# Altium schematic sheet MC21R01_Top_Level.SchDoc: MC21R01 Top Level
size A3; Author: AMP; DrawnBy: AMP; Organization: Altium Limited; Address1: 3 Minna Close; Address2: Belrose; Address3: NSW 2085; Address4: Australia; DocumentNumber: 0; Revision: 1.0; SheetNumber: 0; SheetTotal: 0
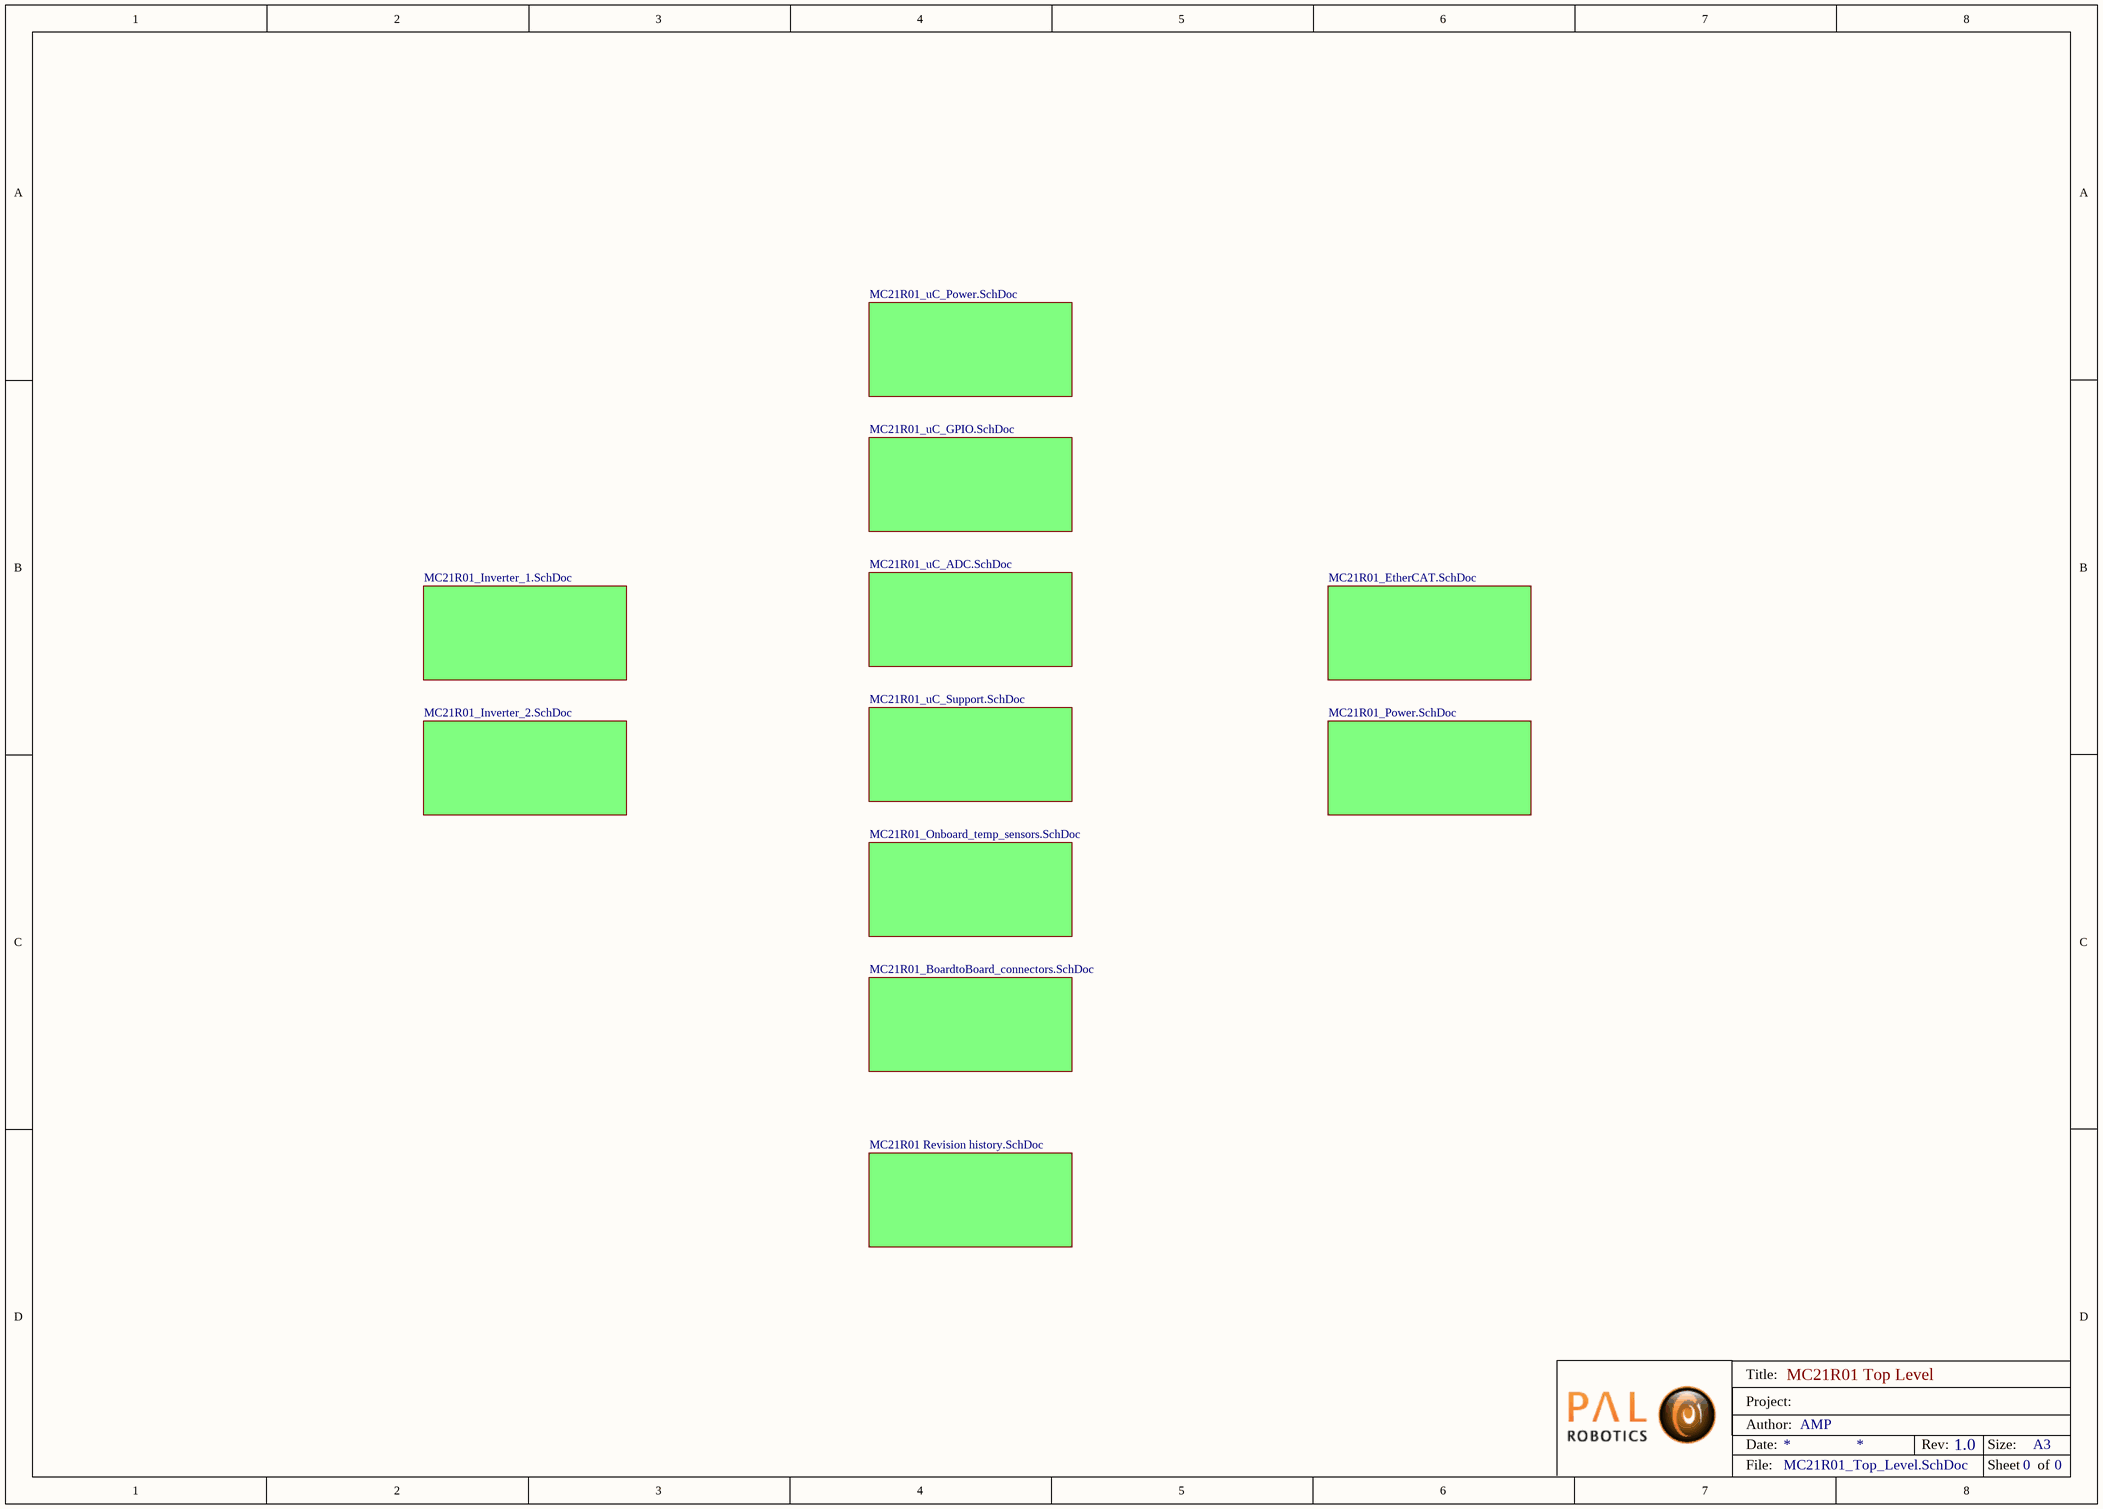
[diagram p0: MC21R01_Top_Level.SchDoc]

## Sub-sheets
? = MC21R01 Revision history.SchDoc: no entries
? = MC21R01_uC_Support.SchDoc: no entries
? = MC21R01_uC_Power.SchDoc: no entries
? = MC21R01_uC_GPIO.SchDoc: no entries
? = MC21R01_Inverter_1.SchDoc: no entries
? = MC21R01_Inverter_2.SchDoc: no entries
? = MC21R01_Onboard_temp_sensors.SchDoc: no entries
? = MC21R01_uC_ADC.SchDoc: no entries
? = MC21R01_EtherCAT.SchDoc: no entries
? = MC21R01_BoardtoBoard_connectors.SchDoc: no entries
? = MC21R01_Power.SchDoc: no entries

## Notes on the sheet
- Title:
- Date:
- Project:
- Author:
- Rev:
- Size:
- A3
- File:
- Sheet
- of